# EasyEDA schematic LcsNodes-Extension-Servo-Board-32-S-B.01.00.json

## Sheets
1 Connectors: REV: B.01.00; Date: 2023-05-06; Sheet: 2/3; Drawn By: helmut-f; Company: Your Company
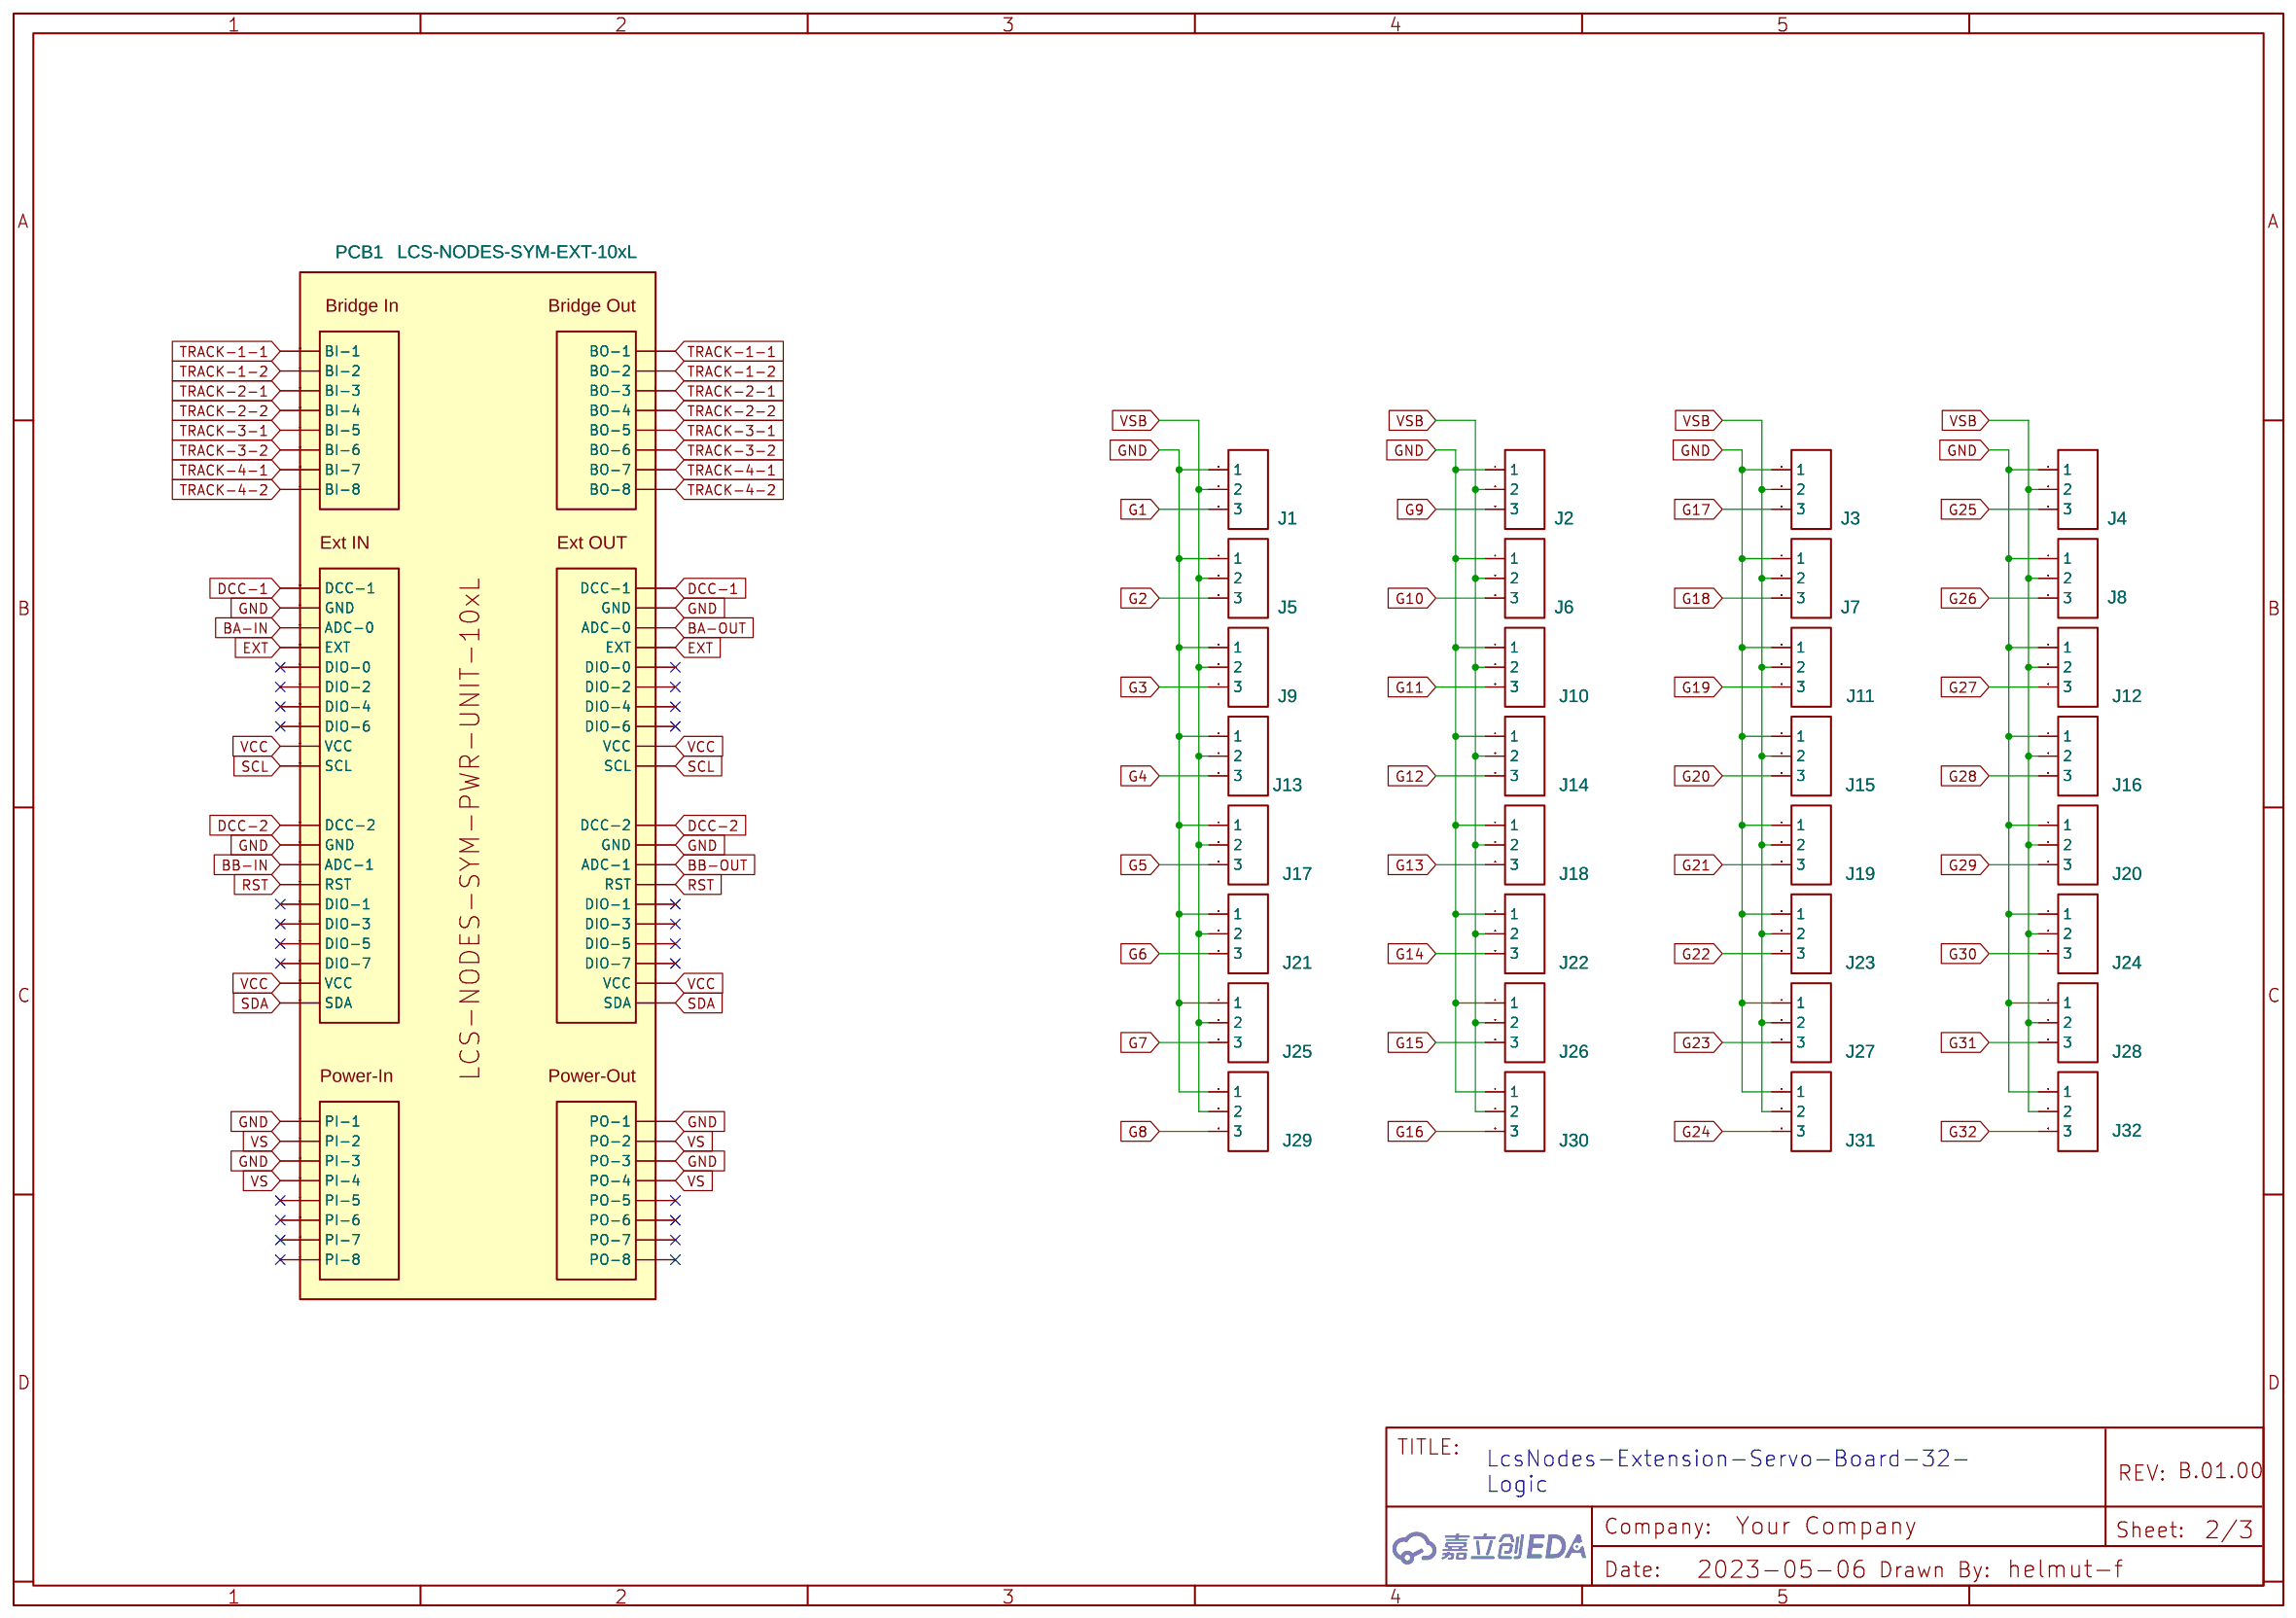
[diagram p0: Connectors]
2 Logic: TITLE: LcsNodes-Extension-Servo-Board-32-\nLogic; Date: 2023-05-07; Sheet: 3/3
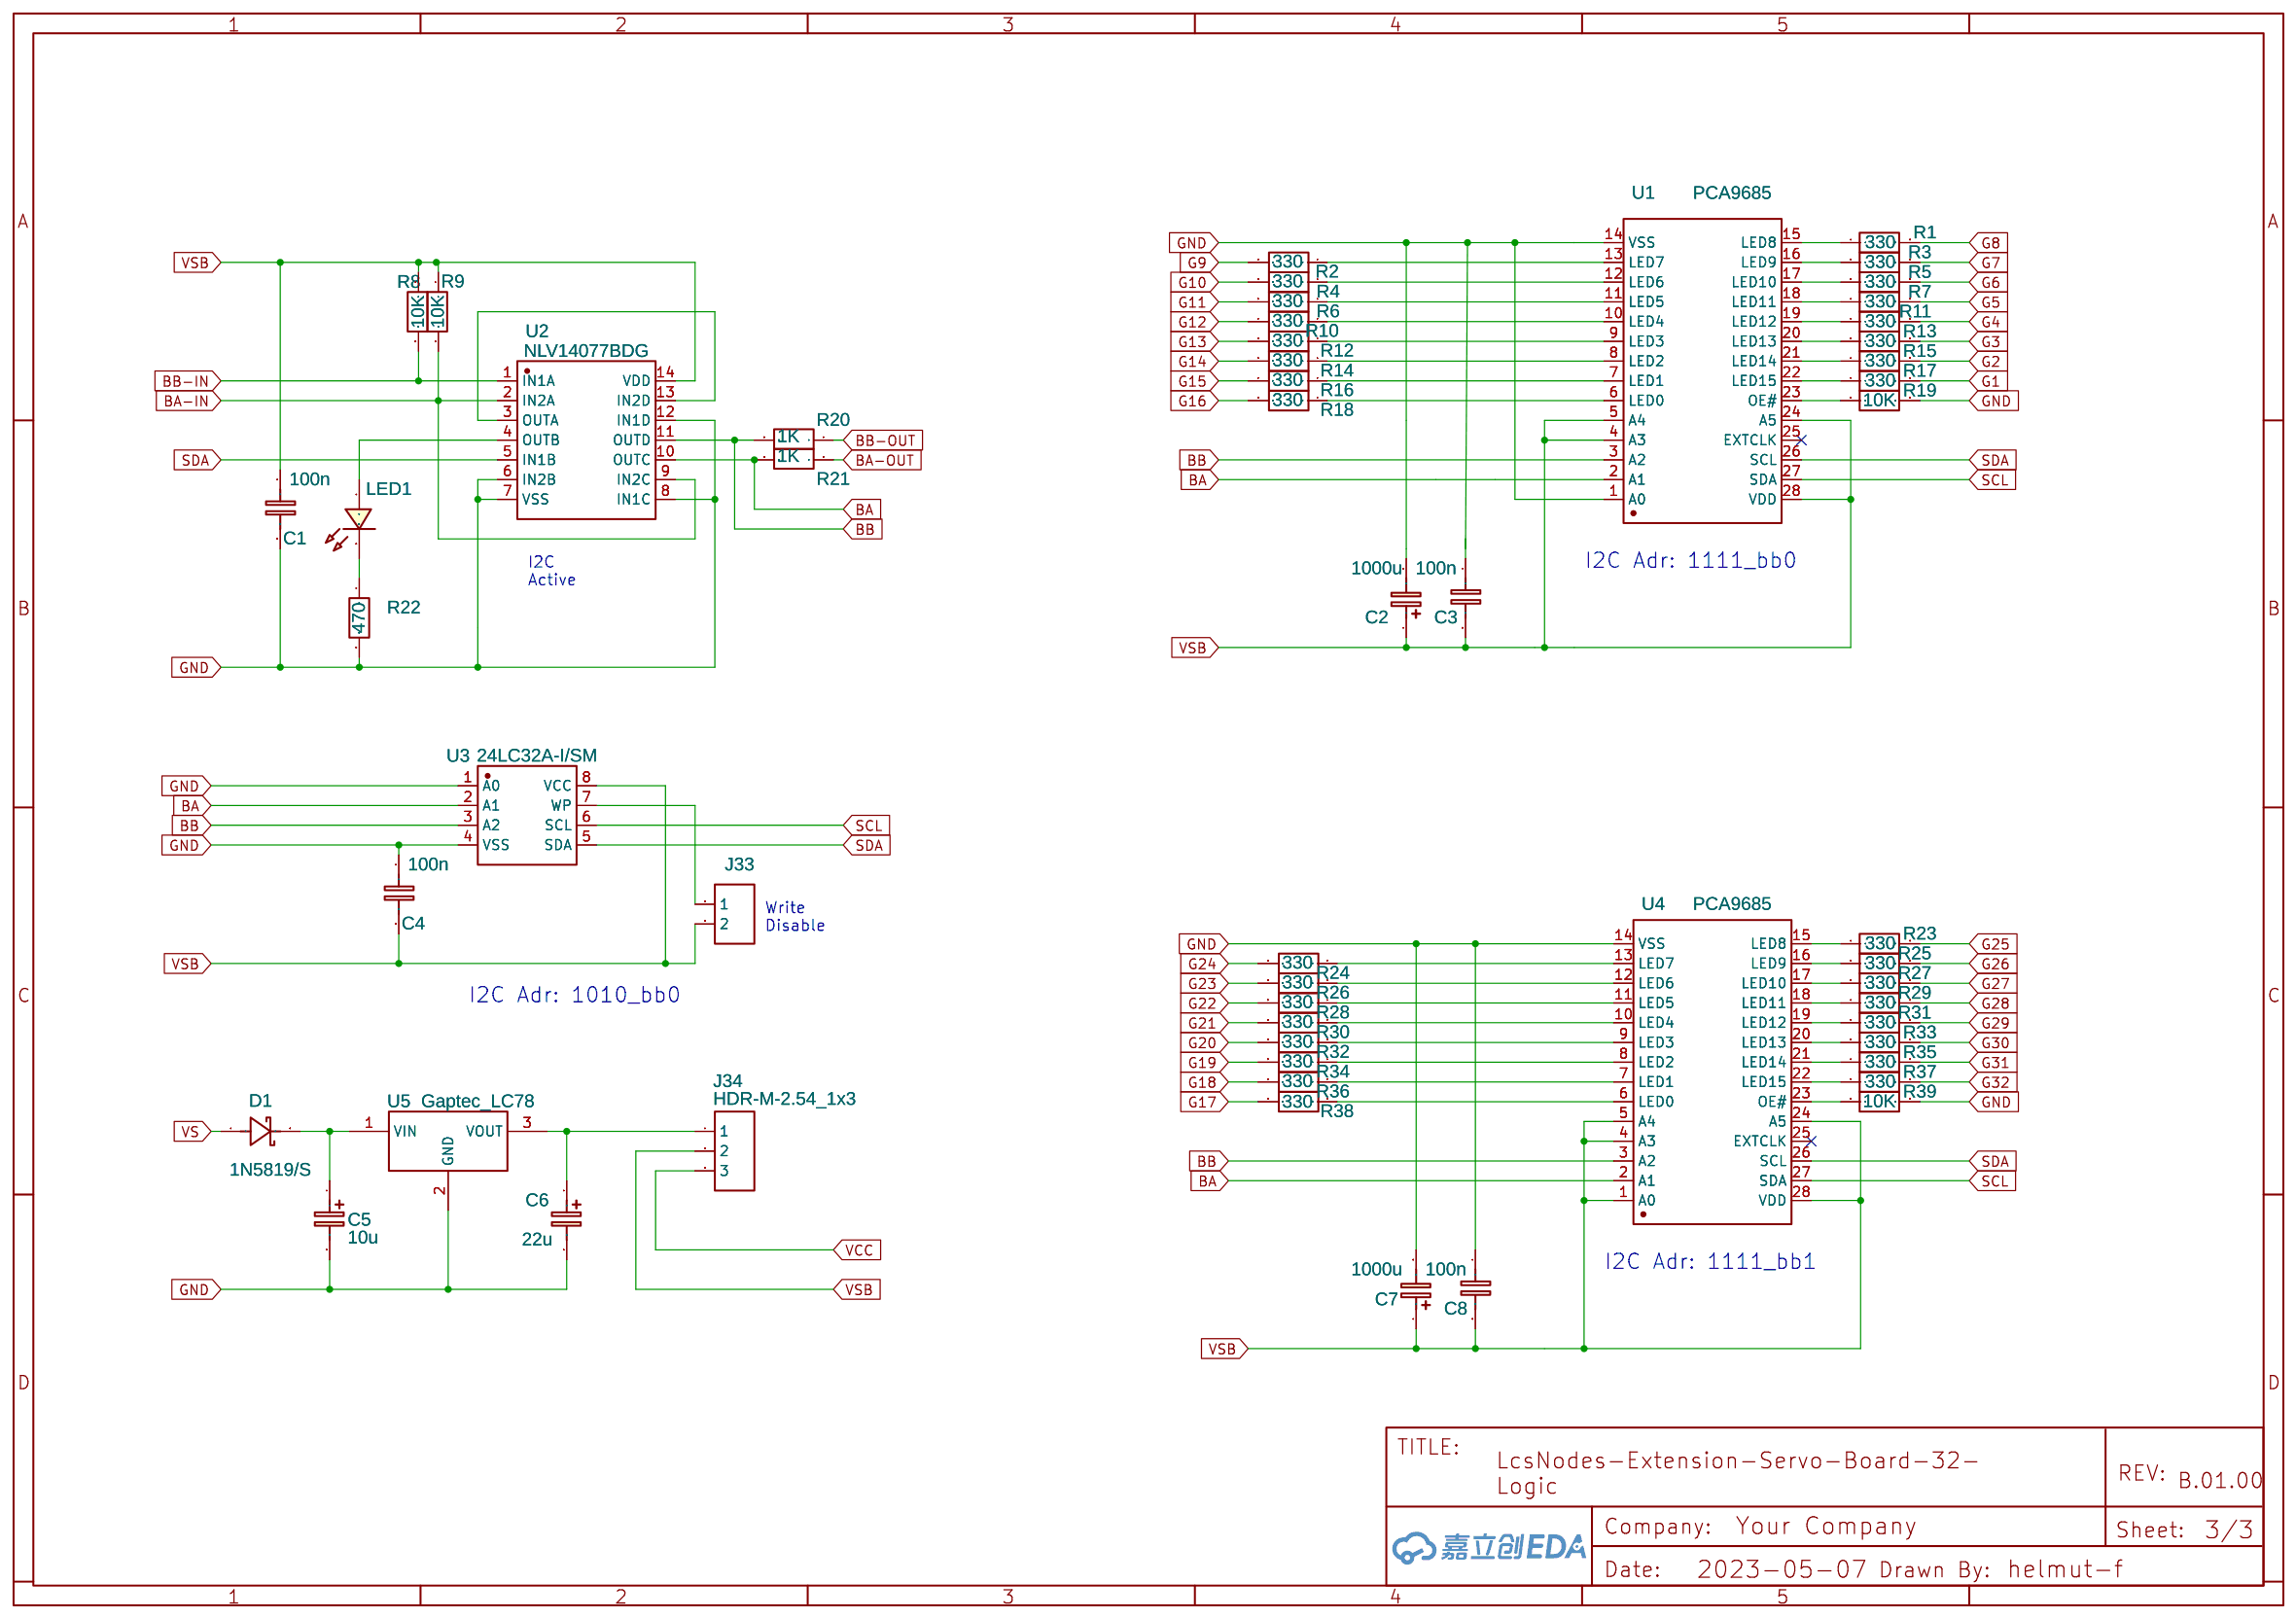
[diagram p1: Logic]
3 High Level Schematic: TITLE: LcsNodes-Extension-Servo-Boards-32-S\nHigh Level Schematic; Date: 2023-05-12; Sheet: 1/3
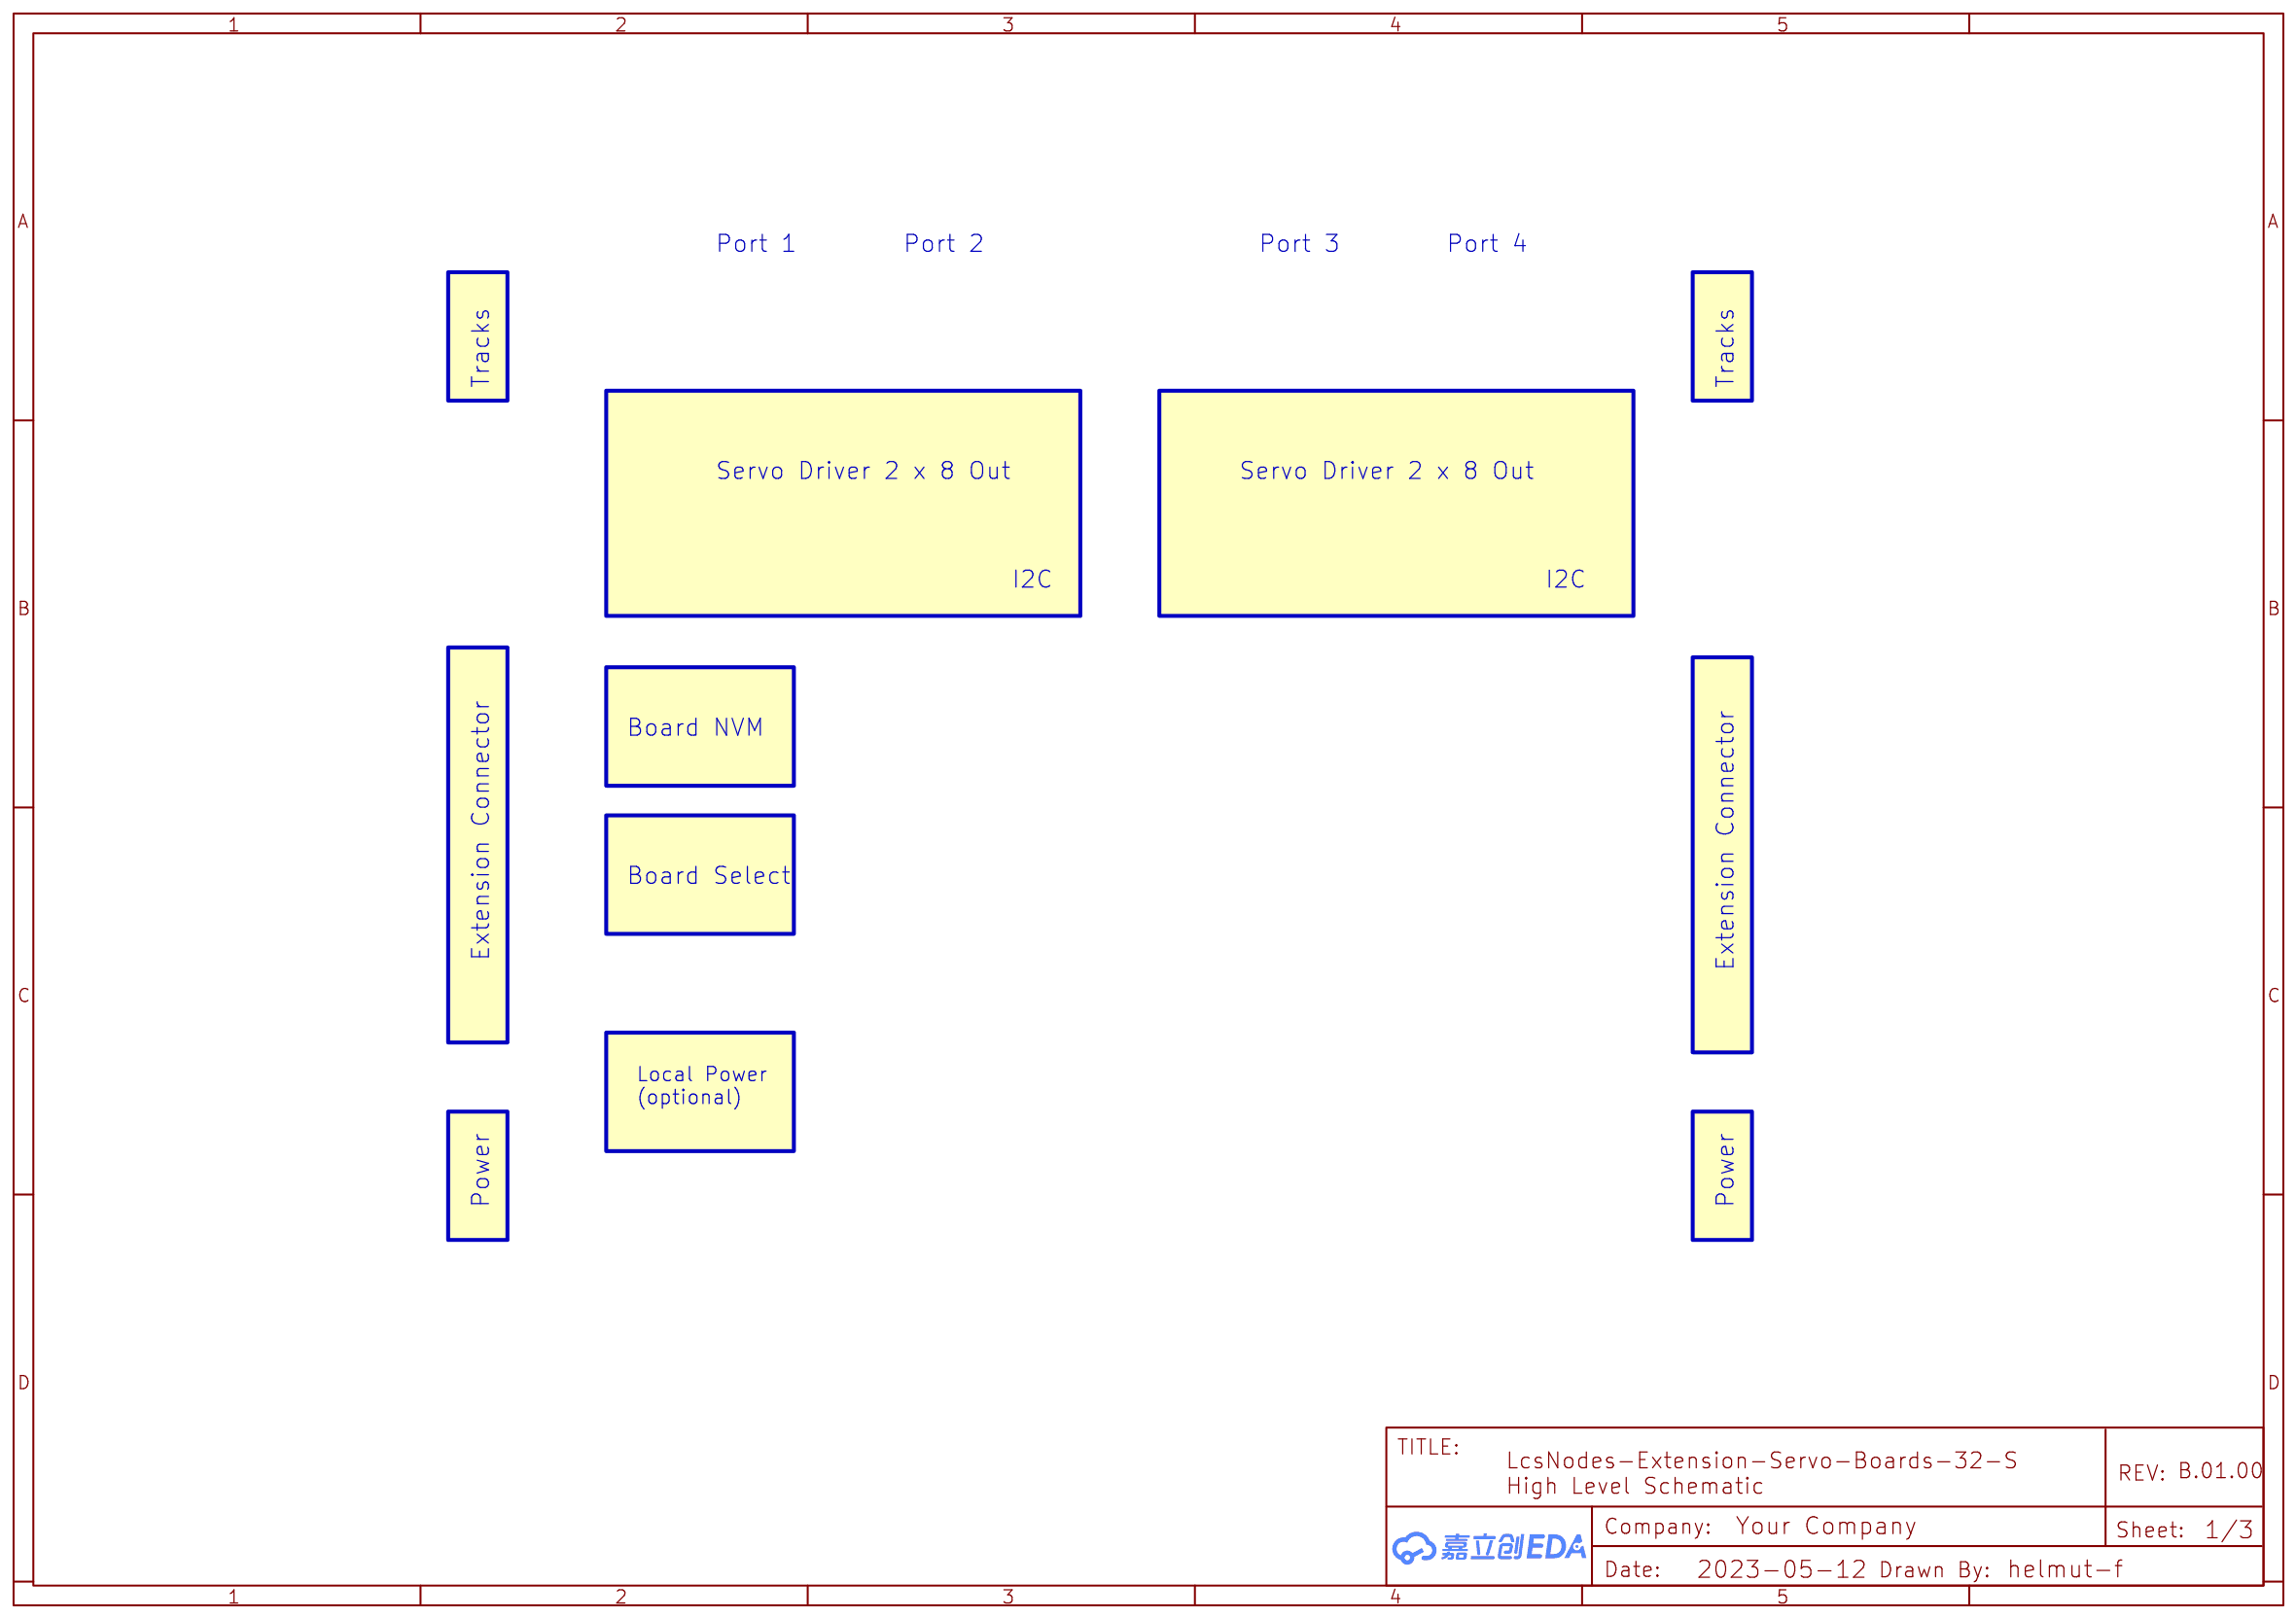
[diagram p2: High Level Schematic]

## Parts
sheet Connectors
J1  HDR-M-2.54_1x3  [HDR-M-2.54_1X3]
J2  HDR-M-2.54_1x3  [HDR-M-2.54_1X3]
J3  HDR-M-2.54_1x3  [HDR-M-2.54_1X3]
J4  HDR-M-2.54_1x3  [HDR-M-2.54_1X3]
J5  HDR-M-2.54_1x3  [HDR-M-2.54_1X3]
J6  HDR-M-2.54_1x3  [HDR-M-2.54_1X3]
J7  HDR-M-2.54_1x3  [HDR-M-2.54_1X3]
J8  HDR-M-2.54_1x3  [HDR-M-2.54_1X3]
J9  HDR-M-2.54_1x3  [HDR-M-2.54_1X3]
J10  HDR-M-2.54_1x3  [HDR-M-2.54_1X3]
J11  HDR-M-2.54_1x3  [HDR-M-2.54_1X3]
J12  HDR-M-2.54_1x3  [HDR-M-2.54_1X3]
J13  HDR-M-2.54_1x3  [HDR-M-2.54_1X3]
J14  HDR-M-2.54_1x3  [HDR-M-2.54_1X3]
J15  HDR-M-2.54_1x3  [HDR-M-2.54_1X3]
J16  HDR-M-2.54_1x3  [HDR-M-2.54_1X3]
J17  HDR-M-2.54_1x3  [HDR-M-2.54_1X3]
J18  HDR-M-2.54_1x3  [HDR-M-2.54_1X3]
J19  HDR-M-2.54_1x3  [HDR-M-2.54_1X3]
J20  HDR-M-2.54_1x3  [HDR-M-2.54_1X3]
J21  HDR-M-2.54_1x3  [HDR-M-2.54_1X3]
J22  HDR-M-2.54_1x3  [HDR-M-2.54_1X3]
J23  HDR-M-2.54_1x3  [HDR-M-2.54_1X3]
J24  HDR-M-2.54_1x3  [HDR-M-2.54_1X3]
J25  HDR-M-2.54_1x3  [HDR-M-2.54_1X3]
J26  HDR-M-2.54_1x3  [HDR-M-2.54_1X3]
J27  HDR-M-2.54_1x3  [HDR-M-2.54_1X3]
J28  HDR-M-2.54_1x3  [HDR-M-2.54_1X3]
J29  HDR-M-2.54_1x3  [HDR-M-2.54_1X3]
J30  HDR-M-2.54_1x3  [HDR-M-2.54_1X3]
J31  HDR-M-2.54_1x3  [HDR-M-2.54_1X3]
J32  HDR-M-2.54_1x3  [HDR-M-2.54_1X3]
PCB1  LCS-NODES-SYM-EXT-10xL  [LCS-NODES-FP-EXT-PCB-10X8]
sheet Logic
C1  100n  [C1206]
C2  1000u  [CAP-SMD_BD10.0-L10.3-W10.3-FD-LS11.0]
C3  100n  [C1206]
C4  100n  [C1206]
C5  10u  [CAP-D5.0×H5.5]
C6  22u  [CAP-D5.0×H5.5]
C7  1000u  [CAP-SMD_BD10.0-L10.3-W10.3-FD-LS11.0]
C8  100n  [C1206]
D1  1N5819/S  [SMA_L4.3-W2.6-LS5.2-R-RD]
J33  HDR-M-2.54_1x2  [HDR-M-2.54_1X2]
J34  HDR-M-2.54_1x3  [HDR-M-2.54_1X3]
LED1  LED-0805_G  [LED-1206]
R1  330  [R1206]
R2  330  [R1206]
R3  330  [R1206]
R4  330  [R1206]
R5  330  [R1206]
R6  330  [R1206]
R7  330  [R1206]
R8  10K  [R1206]
R9  10K  [R1206]
R10  330  [R1206]
R11  330  [R1206]
R12  330  [R1206]
R13  330  [R1206]
R14  330  [R1206]
R15  330  [R1206]
R16  330  [R1206]
R17  330  [R1206]
R18  330  [R1206]
R19  10K  [R1206]
R20  1K  [R1206]
R21  1K  [R1206]
R22  470  [R1206]
R23  330  [R1206]
R24  330  [R1206]
R25  330  [R1206]
R26  330  [R1206]
R27  330  [R1206]
R28  330  [R1206]
R29  330  [R1206]
R30  330  [R1206]
R31  330  [R1206]
R32  330  [R1206]
R33  330  [R1206]
R34  330  [R1206]
R35  330  [R1206]
R36  330  [R1206]
R37  330  [R1206]
R38  330  [R1206]
R39  10K  [R1206]
U1  PCA9685  [TSSOP-28_L9.7-W4.4-P0.65-LS6.4-BL]
U2  NLV14077BDG  [SOIC-14_L8.7-W3.9-P1.27-LS6.0-BL]
U3  24LC32A-I/SM  [SOIC-8_L4.9-W3.9-P1.27-LS6.0-BL]
U4  PCA9685  [TSSOP-28_L9.7-W4.4-P0.65-LS6.4-BL]
U5  Gaptec_LC78  [GAPTEC_LC78]

## Library data of the parts
J1-J32 J34 = HDR-M-2.54_1x3: Supplier Part: C180248; Supplier: LCSC; Contributor: LCEDA_Lib
PCB1 = LCS-NODES-SYM-EXT-10xL: Contributor: helmut-f; Package Display: No
C1 C3 C4 C8 = C_0603_EU: Contributor: LCEDA_Lib; Package Display: No
C2 C7 = CE_TH_D4.0×F1.5_EU: Contributor: LCEDA_Lib
C5 C6 = CE_SMD_D5.0×H5.5_EU: Contributor: LCEDA_Lib
D1 = 1N5819/S: Supplier: LCSC; Supplier Part: C9900003833; JLCPCB Part Class: Extended Part; Contributor: LCSC
J33 = HDR-M-2.54_1x2: Supplier Part: C124375; Supplier: LCSC; Contributor: LCEDA_Lib
LED1 = LED-0805_G: Manufacturer: 国星光电; Manufacturer Part: NCD0805G1; Supplier Part: C84260; Contributor: LCEDA_Lib
R1 R3-R21 R23 R25-R39 = R_AXIAL-0.3_EU: Contributor: LCEDA_Lib
R2 R24 = R_AXIAL-0.3_EU: Contributor: LCEDA_Lib; Package Display: No
R22 = R_0805_EU: Contributor: LCEDA_Lib
U1 U4 = PCA9685PW/Q900,118: Supplier: LCSC; Manufacturer: NXP; Supplier Part: C92206; JLCPCB Part Class: Extended Part; Package Display: No
U2 = NLV14077BDG: Supplier: LCSC; Supplier Part: C897321; Manufacturer: onsemi(安森美); Contributor: LCSC; JLCPCB Part Class: Extended Part
U3 = 24LC32A-I/SM: Contributor: LCSC; Supplier: LCSC; Supplier Part: C616088; Manufacturer: MICROCHIP(美国微芯); JLCPCB Part Class: Extended Part
U5 = Gaptec_LC78: Contributor: SpicyMemeBoi; Package Display: No

## Nets
GND: C1.2 C2.2 C3.1 C4.1 C5.2 C6.2 C7.2 C8.1 J1.1 J2.1 J3.1 J4.1 J5.1 J6.1 J7.1 J8.1 J9.1 J10.1 J11.1 J12.1 J13.1 J14.1 J15.1 J16.1 J17.1 J18.1 J19.1 J20.1 J21.1 J22.1 J23.1 J24.1 J25.1 J26.1 J27.1 J28.1 J29.1 J30.1 J31.1 J32.1 PCB1.21(GND) PCB1.31(GND) PCB1.40(PI-1) PCB1.42(PI-3) PCB1.61(GND) PCB1.71(GND) PCB1.80(PO-1) PCB1.82(PO-3) R19.2 R22.2 R39.2 U1.1(A0) U1.14(VSS) U2.6(IN2B) U2.7(VSS) U2.8(IN1C) U2.12(IN1D) U3.1(A0) U3.4(VSS) U4.14(VSS) U5.2(GND)
VCC: J34.3 PCB1.28(VCC) PCB1.38(VCC) PCB1.68(VCC) PCB1.78(VCC)
BA: R21.2 U1.2(A1) U2.10(OUTC) U3.2(A1) U4.2(A1)
BA-IN: PCB1.22(ADC-0) R9.2 U2.2(IN2A) U2.9(IN2C)
BA-OUT: PCB1.62(ADC-0) R21.1
BB: R20.2 U1.3(A2) U2.11(OUTD) U3.3(A2) U4.3(A2)
BB-IN: PCB1.32(ADC-1) R8.2 U2.1(IN1A)
BB-OUT: PCB1.72(ADC-1) R20.1
DCC-1: PCB1.20(DCC-1) PCB1.60(DCC-1)
DCC-2: PCB1.30(DCC-2) PCB1.70(DCC-2)
EXT: PCB1.23(EXT) PCB1.63(EXT)
G1: J1.3 R17.2
G2: J5.3 R15.2
G3: J9.3 R13.2
G4: J13.3 R11.2
G5: J17.3 R7.2
G6: J21.3 R5.2
G7: J25.3 R3.2
G8: J29.3 R1.2
G9: J2.3 R2.2
G10: J6.3 R4.2
G11: J10.3 R6.2
G12: J14.3 R10.2
G13: J18.3 R12.2
G14: J22.3 R14.2
G15: J26.3 R16.2
G16: J30.3 R18.2
G17: J3.3 R38.2
G18: J7.3 R36.2
G19: J11.3 R34.2
G20: J15.3 R32.2
G21: J19.3 R30.2
G22: J23.3 R28.2
G23: J27.3 R26.2
G24: J31.3 R24.2
G25: J4.3 R23.2
G26: J8.3 R25.2
G27: J12.3 R27.2
G28: J16.3 R29.2
G29: J20.3 R31.2
G30: J24.3 R33.2
G31: J28.3 R35.2
G32: J32.3 R37.2
RST: PCB1.33(RST) PCB1.73(RST)
SCL: PCB1.29(SCL) PCB1.69(SCL) U1.27(SDA) U3.6(SCL) U4.27(SDA)
SDA: PCB1.39(SDA) PCB1.79(SDA) U1.26(SCL) U2.5(IN1B) U3.5(SDA) U4.26(SCL)
TRACK-1-1: PCB1.10(BI-1) PCB1.50(BO-1)
TRACK-1-2: PCB1.11(BI-2) PCB1.51(BO-2)
TRACK-2-1: PCB1.12(BI-3) PCB1.52(BO-3)
TRACK-2-2: PCB1.13(BI-4) PCB1.53(BO-4)
TRACK-3-1: PCB1.14(BI-5) PCB1.54(BO-5)
TRACK-3-2: PCB1.15(BI-6) PCB1.55(BO-6)
TRACK-4-1: PCB1.16(BI-7) PCB1.56(BO-7)
TRACK-4-2: PCB1.17(BI-8) PCB1.57(BO-8)
VS: D1.1(A) PCB1.41(PI-2) PCB1.43(PI-4) PCB1.81(PO-2) PCB1.83(PO-4)
VSB: C1.1 C2.1 C3.2 C4.2 C7.1 C8.2 J1.2 J2.2 J3.2 J4.2 J5.2 J6.2 J7.2 J8.2 J9.2 J10.2 J11.2 J12.2 J13.2 J14.2 J15.2 J16.2 J17.2 J18.2 J19.2 J20.2 J21.2 J22.2 J23.2 J24.2 J25.2 J26.2 J27.2 J28.2 J29.2 J30.2 J31.2 J32.2 J33.2 J34.2 R8.1 R9.1 U1.4(A3) U1.5(A4) U1.24(A5) U1.28(VDD) U2.14(VDD) U3.8(VCC) U4.1(A0) U4.4(A3) U4.5(A4) U4.24(A5) U4.28(VDD)
Net-(C5-1): C5.1 D1.2(K) U5.1(VIN)
Net-(C6-1): C6.1 J34.1 U5.3(VOUT)
Net-(J33-1): J33.1 U3.7(WP)
Net-(LED1-1): LED1.1 U2.4(OUTB)
Net-(LED1-2): LED1.2 R22.1
Net-(R1-1): R1.1 U1.15(LED8)
Net-(R2-1): R2.1 U1.13(LED7)
Net-(R3-1): R3.1 U1.16(LED9)
Net-(R4-1): R4.1 U1.12(LED6)
Net-(R5-1): R5.1 U1.17(LED10)
Net-(R6-1): R6.1 U1.11(LED5)
Net-(R7-1): R7.1 U1.18(LED11)
Net-(R10-1): R10.1 U1.10(LED4)
Net-(R11-1): R11.1 U1.19(LED12)
Net-(R12-1): R12.1 U1.9(LED3)
Net-(R13-1): R13.1 U1.20(LED13)
Net-(R14-1): R14.1 U1.8(LED2)
Net-(R15-1): R15.1 U1.21(LED14)
Net-(R16-1): R16.1 U1.7(LED1)
Net-(R17-1): R17.1 U1.22(LED15)
Net-(R18-1): R18.1 U1.6(LED0)
Net-(R19-1): R19.1 U1.23(OE#)
Net-(R23-1): R23.1 U4.15(LED8)
Net-(R24-1): R24.1 U4.13(LED7)
Net-(R25-1): R25.1 U4.16(LED9)
Net-(R26-1): R26.1 U4.12(LED6)
Net-(R27-1): R27.1 U4.17(LED10)
Net-(R28-1): R28.1 U4.11(LED5)
Net-(R29-1): R29.1 U4.18(LED11)
Net-(R30-1): R30.1 U4.10(LED4)
Net-(R31-1): R31.1 U4.19(LED12)
Net-(R32-1): R32.1 U4.9(LED3)
Net-(R33-1): R33.1 U4.20(LED13)
Net-(R34-1): R34.1 U4.8(LED2)
Net-(R35-1): R35.1 U4.21(LED14)
Net-(R36-1): R36.1 U4.7(LED1)
Net-(R37-1): R37.1 U4.22(LED15)
Net-(R38-1): R38.1 U4.6(LED0)
Net-(R39-1): R39.1 U4.23(OE#)
Net-(U2-3): U2.3(OUTA) U2.13(IN2D)

Not connected (* = marked no-connect by the designer): PCB1 24(DIO-0)* 25(DIO-2)* 26(DIO-4)* 27(DIO-6)* 34(DIO-1)* 35(DIO-3)* 36(DIO-5)* 37(DIO-7)* 44(PI-5)* 45(PI-6)* 46(PI-7)* 47(PI-8)* 64(DIO-0)* 65(DIO-2)* 66(DIO-4)* 67(DIO-6)* 74(DIO-1)* 75(DIO-3)* 76(DIO-5)* 77(DIO-7)* 84(PO-5)* 85(PO-6)* 86(PO-7)* 87(PO-8)*; U1 25(EXTCLK)*; U4 25(EXTCLK)*

## Notes on the sheets
sheet 1
- LcsNodes-Extension-Servo-Board-32-
  Logic
sheet 2
- I2C
  Active
- I2C Adr: 1111_bb0
- Write
  Disable
- I2C Adr: 1010_bb0
- I2C Adr: 1111_bb1
sheet 3
- Port 1
- Port 2
- Port 3
- Port 4
- Tracks
- Tracks
- Servo Driver 2 x 8 Out
- Servo Driver 2 x 8 Out
- I2C
- I2C
- Board NVM
- Board Select
- Extension Connector
- Extension Connector
- Local Power
  (optional)
- Power
- Power
